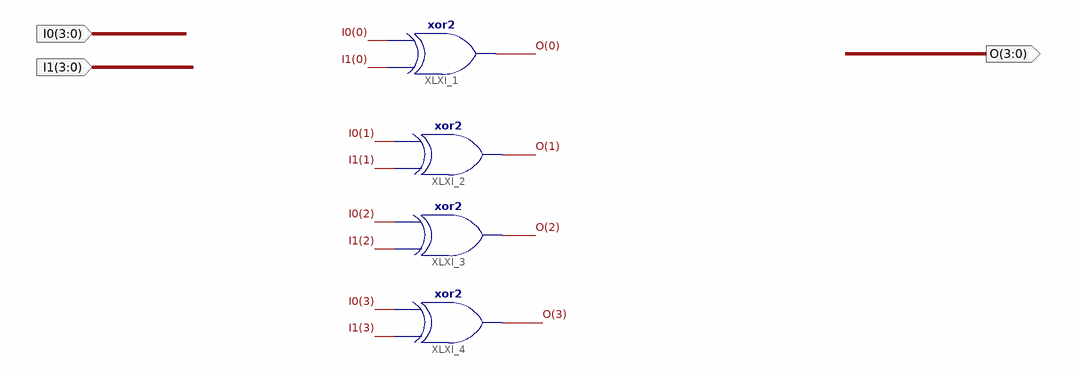
[diagram p0: schematic sheet 1]
// Xilinx ISE schematic xor4b2.sch (spartan3e) as structural Verilog: 4 symbols, 3 ports
module xor4b2 (
  input  [3:0] I0,
  input  [3:0] I1,
  output [3:0] O
);

  xor XLXI_1 (O[0], I1[0], I0[0]);
  xor XLXI_2 (O[1], I1[1], I0[1]);
  xor XLXI_3 (O[2], I1[2], I0[2]);
  xor XLXI_4 (O[3], I1[3], I0[3]);
endmodule
